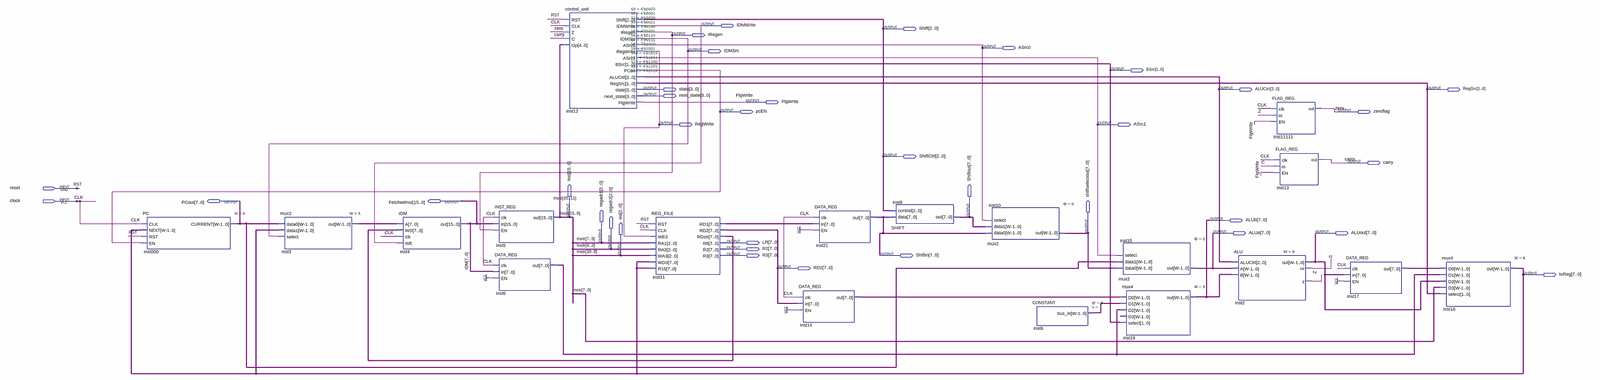
[diagram p0: schematic sheet, whole]
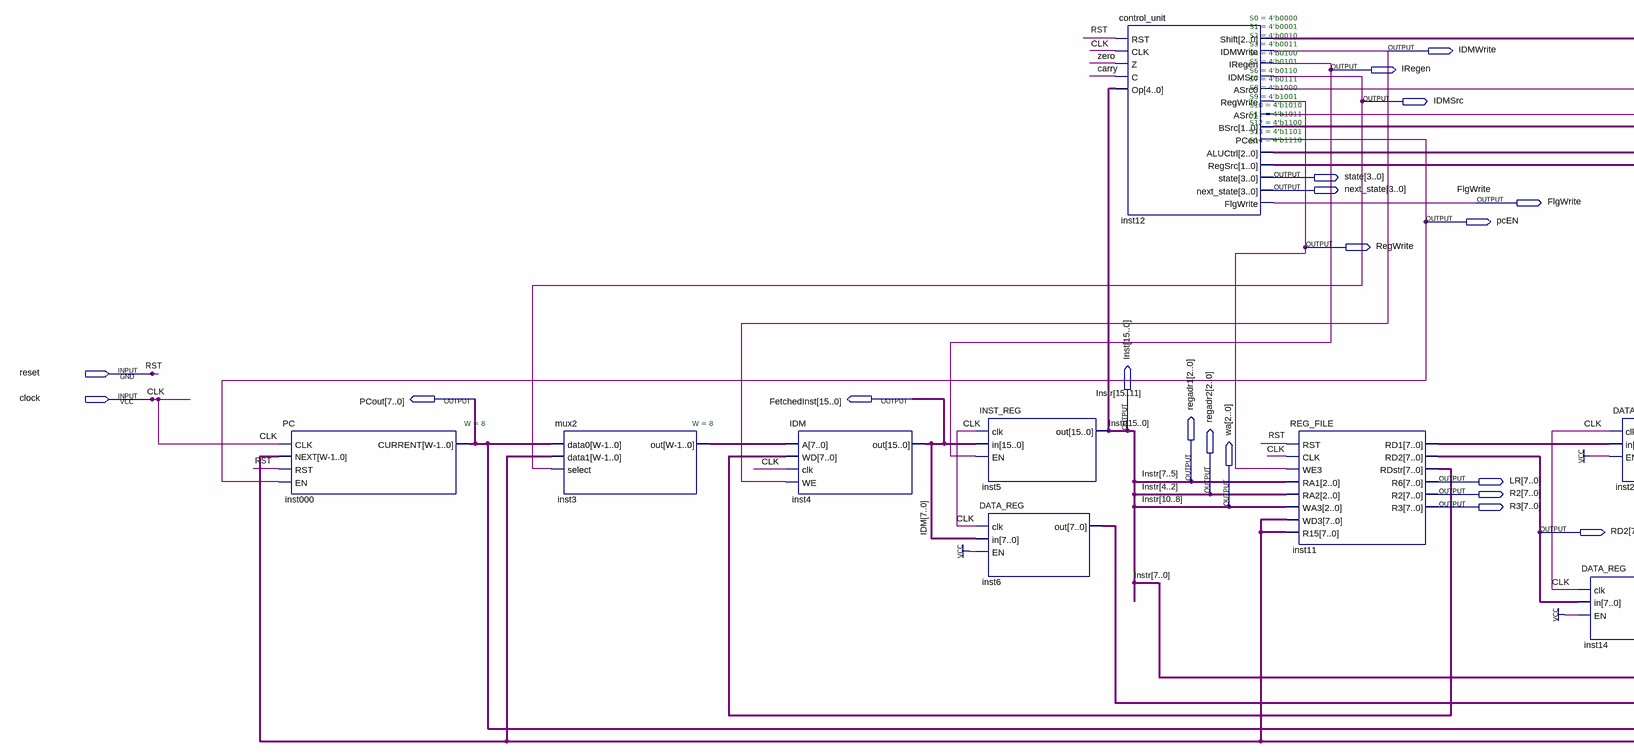
[diagram p1: schematic sheet, left part]
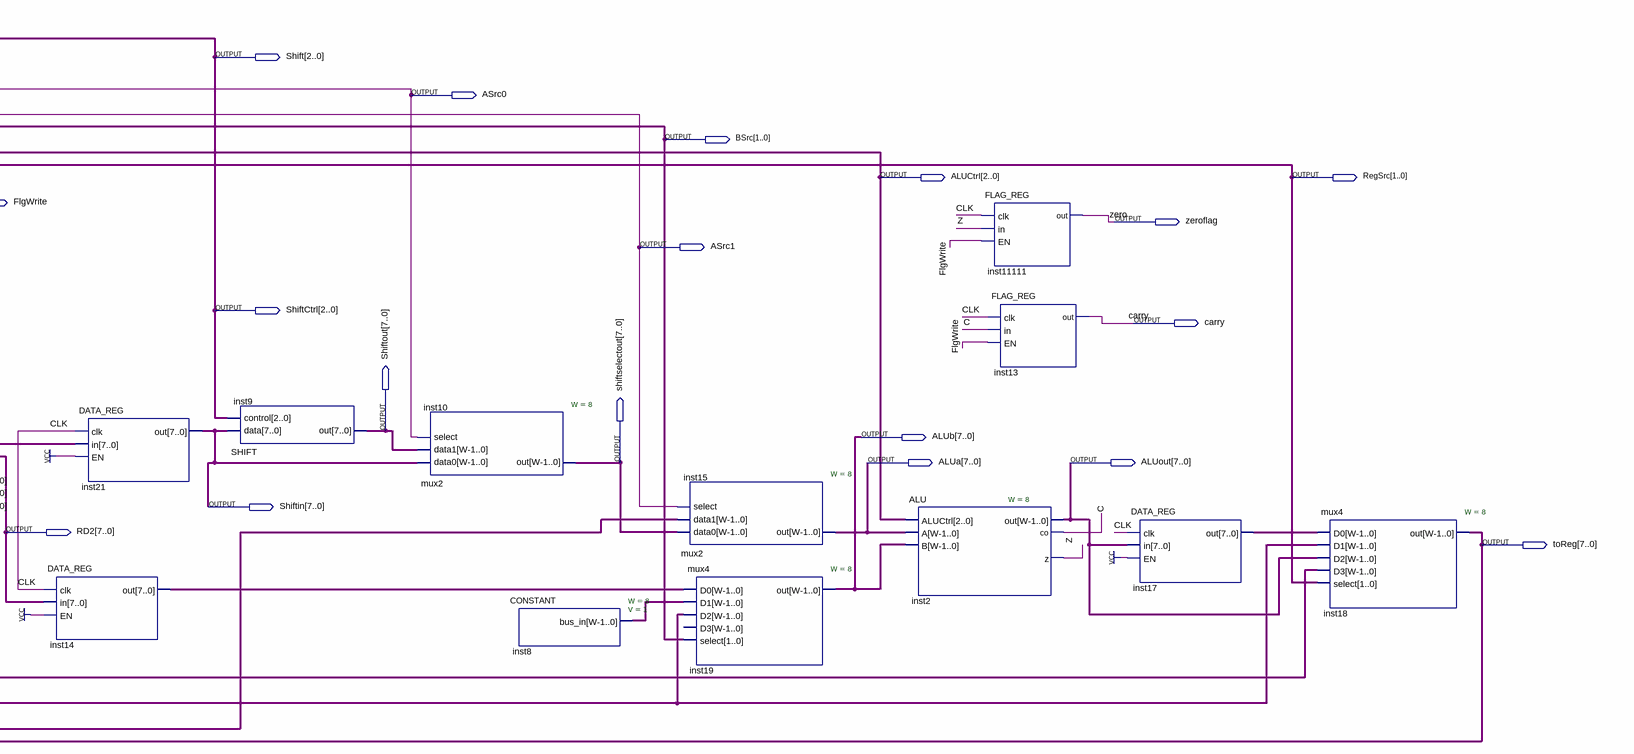
[diagram p2: schematic sheet, right part]
// Quartus schematic multicycle.bdf as structural Verilog: 19 symbols, 36 pins
module multicycle (
  input  reset,
  input  clock,
  output IDMWrite,
  output [2:0] Shift,
  output IRegen,
  output ASrc0,
  output IDMSrc,
  output [1:0] BSrc,
  output [3:0] state,
  output [2:0] ALUCtrl,
  output [1:0] RegSrc,
  output [3:0] next_state,
  output FlgWrite,
  output pcEN,
  output zeroflag,
  output RegWrite,
  output ASrc1,
  output [2:0] ShiftCtrl,
  output carry,
  output [7:0] PCout,
  output [15:0] FetchedInst,
  output [15:0] Inst,
  output [7:0] Shiftout,
  output [7:0] ALUb,
  output [7:0] shiftselectout,
  output [7:0] ALUa,
  output [7:0] ALUout,
  output [2:0] regadr1,
  output [7:0] LR,
  output [2:0] regadr2,
  output [7:0] R2,
  output [2:0] wa,
  output [7:0] R3,
  output [7:0] Shiftin,
  output [7:0] RD2,
  output [7:0] toReg
);

  wire C, Z;
  wire [7:0] inst3_out, inst6_out, inst8_bus_in, inst11_rd1, inst11_rdstr, inst14_out, inst17_out;

  PC #(.W(8)) inst000 (.CLK(clock), .NEXT(toReg), .RST(reset), .EN(pcEN), .CURRENT(PCout));
  mux2 #(.W(8)) inst3 (.data0(PCout), .data1(toReg), .select(IDMSrc), .out(inst3_out));
  IDM inst4 (.A(inst3_out), .WD(inst11_rdstr), .clk(clock), .WE(IDMWrite), .out(FetchedInst));
  INST_REG inst5 (.clk(clock), .in(FetchedInst), .EN(IRegen), .out(Inst));
  DATA_REG inst6 (.clk(clock), .in(FetchedInst[7:0]), .EN(1'b1), .out(inst6_out));
  control_unit #(.S0(4'b0000), .S1(4'b0001), .S2(4'b0010), .S3(4'b0011), .S4(4'b0100), .S5(4'b0101), .S6(4'b0110), .S7(4'b0111), .S8(4'b1000), .S9(4'b1001), .S10(4'b1010), .S11(4'b1011), .S12(4'b1100), .S13(4'b1101), .S14(4'b1110)) inst12 (
    .RST(reset), .CLK(clock), .Z(zeroflag), .C(carry), .Op(Inst[15:11]), .Shift(Shift), .IDMWrite(IDMWrite),
    .IRegen(IRegen), .IDMSrc(IDMSrc), .ASrc0(ASrc0), .RegWrite(RegWrite), .ASrc1(ASrc1), .BSrc(BSrc),
    .PCen(pcEN), .ALUCtrl(ALUCtrl), .RegSrc(RegSrc), .state(state), .next_state(next_state),
    .FlgWrite(FlgWrite));
  REG_FILE inst11 (
    .RST(reset), .CLK(clock), .WE3(RegWrite), .RA1(Inst[7:5]), .RA2(Inst[4:2]), .WA3(Inst[10:8]),
    .WD3(toReg), .R15(toReg), .RD1(inst11_rd1), .RD2(RD2), .RDstr(inst11_rdstr), .R6(LR), .R2(R2), .R3(R3));
  DATA_REG inst21 (.clk(clock), .in(inst11_rd1), .EN(1'b1), .out(Shiftin));
  DATA_REG inst14 (.clk(clock), .in(RD2), .EN(1'b1), .out(inst14_out));
  SHIFT inst9 (.data(Shiftin), .control(Shift), .out(Shiftout));
  mux2 #(.W(8)) inst10 (.data0(Shiftin), .data1(Shiftout), .select(ASrc0), .out(shiftselectout));
  CONSTANT #(.W(8), .V(1)) inst8 (.bus_in(inst8_bus_in));
  mux2 #(.W(8)) inst15 (.data0(shiftselectout), .data1(PCout), .select(ASrc1), .out(ALUa));
  mux4 #(.W(8)) inst19 (.D0(inst14_out), .D1(inst8_bus_in), .D2(inst6_out), .select(BSrc), .out(ALUb));  // open: D3
  ALU #(.W(8)) inst2 (.ALUCtrl(ALUCtrl), .A(ALUa), .B(ALUb), .out(ALUout), .co(C), .z(Z));
  FLAG_REG inst11111 (.clk(clock), .in(Z), .EN(FlgWrite), .out(zeroflag));
  FLAG_REG inst13 (.clk(clock), .in(C), .EN(FlgWrite), .out(carry));
  DATA_REG inst17 (.clk(clock), .in(ALUout), .EN(1'b1), .out(inst17_out));
  mux4 #(.W(8)) inst18 (.D0(inst17_out), .D1(inst6_out), .D2(ALUout), .D3(Inst[7:0]), .select(RegSrc), .out(toReg));

  assign regadr1 = Inst[7:5];
  assign regadr2 = Inst[4:2];
  assign ShiftCtrl = Shift;
  assign wa = Inst[10:8];

  // Other names for the same wires on the sheet: CLK = clock; IDM[15:0] = FetchedInst; Instr[15:0] = Inst;
  //   RST = reset; zero = zeroflag
endmodule
